# Altium schematic sheet start.SchDoc
size A4
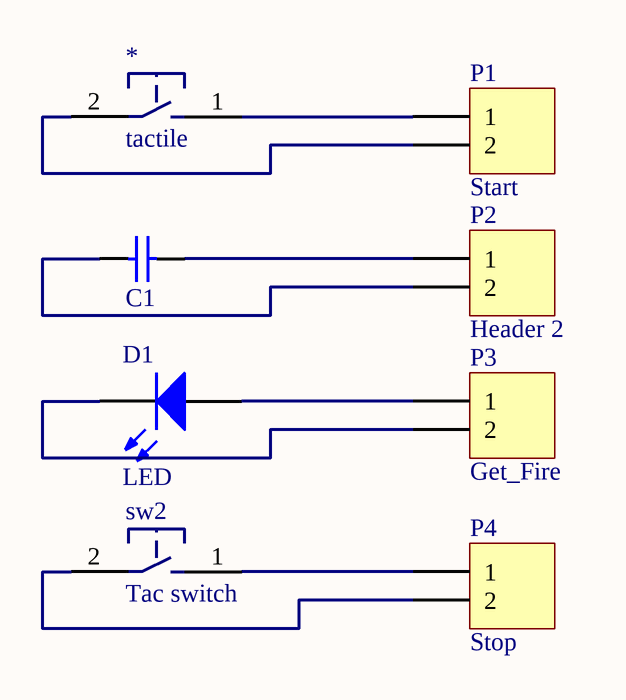
[diagram p0: start.SchDoc]

## Parts
*  tactile  [tactile]
C1  Cap  [My_cap100n]  (value not drawn)
D1  LED  [My_LED3MM]
P1  Start  [HDR1X2]
P2  Header 2  [HDR1X2]
P3  Get_Fire  [HDR1X2]
P4  Stop  [HDR1X2]
sw2  Tac switch  [MY_TACTILE-PTH]

## Nets
Net*_1: *.1 P1.1
Net*_2: *.2 P1.2
NetC1_1: C1.1 P2.2
NetC1_2: C1.2 P2.1
NetD1_A: D1.A P3.1
NetD1_K: D1.K P3.2
NetP4_1: P4.1 sw2.1
NetP4_2: P4.2 sw2.2

## Library data of the parts
C1 = Cap ceramic: CAP-100Nf; Value: 100nF
D1 = LED: Typical INFRARED GaAs LED; Published: 8-Jun-2000; LatestRevisionDate: 08-Jul-2005; LatestRevisionNote: Mech Layer 1 removed.; Publisher: Altium Limited
P1-P4 = Header 2: Header, 2-Pin; LatestRevisionDate: 17-Jul-2002; LatestRevisionNote: Re-released for DXP Platform.; Publisher: Altium Limited
sw2 = Tac switch: small tac switch